# EAGLE schematic Column_PCB_Schematic (EAGLE 7.5.0), part 3 of 3
## Notes on the sheet
- I/O Ribbon Cables

## Power pins joined to a net without a drawn wire
GND: IC1.4(GND)
VCC: IC1.12(VCC)

## Library data of the parts
C1-C13 = adafruit:C-US: CAPACITOR, American symbol
IC1 = 74ac-logic:74AC11238: 3 to 8 line DECODER/DEMULTIPLEXER
MUX_SEL = con-rib:SH5-4: RIBBON CABLE CONNECTOR Flachstecker / Faston; OC_FARNELL: unknown; OC_NEWARK: unknown
PIN1-PIN7 = con-samtec:SSW-101-02-S-S: THROUGH-HOLE .025" SQ POST SOCKET Source: Samtec SSW.pdf; MPN: SSW-101-02-S-S; OC_FARNELL: unknown; OC_NEWARK: 11P9336
PWRSEL = con-rib:SH5-3: RIBBON CABLE CONNECTOR Flachstecker / Faston; OC_FARNELL: unknown; OC_NEWARK: unknown
RN1 = resistor-sil:G08R: SIL RESISTOR; OC_FARNELL: unknown; OC_NEWARK: unknown
U$1-U$12 = SparkFun-AnalogIC:MUX-74HC4067: 16-channel analog MUX; PROD_ID: IC-08252
X4-X7 X10-X13 X16-X19 X22-X25 X28-X31 X34-X37 X40-X43 = con-samtec:SSW-140-02-S-S: THROUGH-HOLE .025" SQ POST SOCKET Source: Samtec SSW.pdf; MPN: SSW-140-02-S-S; OC_FARNELL: unknown; OC_NEWARK: 11P9957
X8 X14 X20 X26 X32 X38 X44 = con-samtec:SSW-105-02-S-S: THROUGH-HOLE .025" SQ POST SOCKET Source: Samtec SSW.pdf; MPN: SSW-105-02-S-S; OC_FARNELL: unknown; OC_NEWARK: 11P9399
X9 X15 X21 X27 X33 X39 X45 = con-samtec:SSW-104-02-S-S: THROUGH-HOLE .025" SQ POST SOCKET Source: Samtec SSW.pdf; MPN: SSW-104-02-S-S; OC_FARNELL: unknown; OC_NEWARK: 11P9384

## Module MUX_PULLDOWN-NETWORK
Ports: 

### Library data of the parts

## Module MUX_PULLDOWN_16_TO_BUS
Ports: BUS0(io) BUS1(io) BUS2(io) BUS3(io) BUS4(io) BUS5(io) BUS6(io) BUS7(io) BUS8(io) BUS9(io) BUS10(io) BUS11(io) BUS12(io) BUS13(io) BUS14(io) BUS15(io) GND(io) BUS[0..15](io)
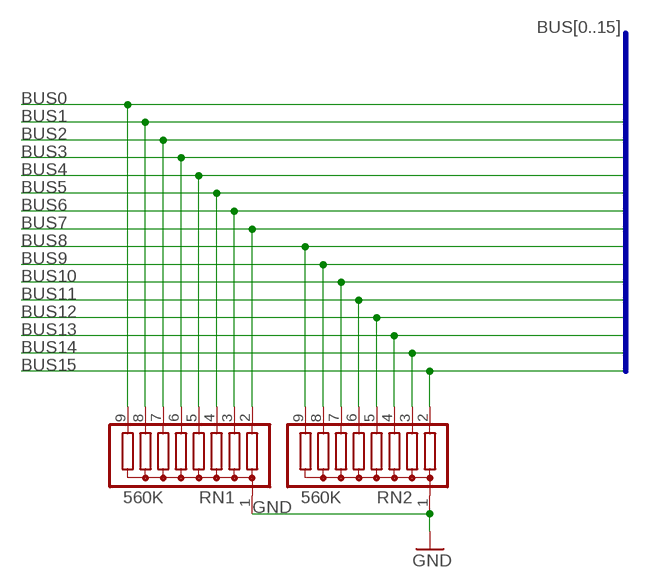
[diagram p8: schematic, module MUX_PULLDOWN_16_TO_BUS, sheet 1]

### Parts
RN1  560K  G08R  [SIL9]
RN2  560K  G08R  [SIL9]

### Nets
BUS0: RN1.9
BUS1: RN1.8
BUS2: RN1.7
BUS3: RN1.6
BUS4: RN1.5
BUS5: RN1.4
BUS6: RN1.3
BUS7: RN1.2
BUS8: RN2.9
BUS9: RN2.8
BUS10: RN2.7
BUS11: RN2.6
BUS12: RN2.5
BUS13: RN2.4
BUS14: RN2.3
BUS15: RN2.2
GND: RN1.1 RN2.1

### Buses
BUS[0..15]

### Library data of the parts
RN1 RN2 = resistor-sil:G08R: SIL RESISTOR; OC_FARNELL: unknown; OC_NEWARK: unknown

## Module 16_TO_BUS
Ports: BUS15(io) BUS14(io) BUS13(io) BUS12(io) BUS11(io) BUS10(io) BUS9(io) BUS8(io) BUS7(io) BUS6(io) BUS5(io) BUS4(io) BUS3(io) BUS2(io) BUS1(io) BUS0(io) BUS[0..15](io)
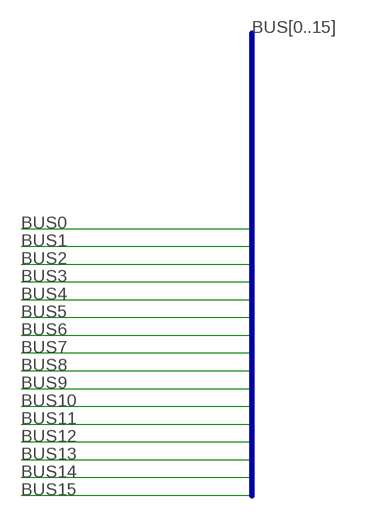
[diagram p9: schematic, module 16_TO_BUS, sheet 1]

### Buses
BUS[0..15]

### Library data of the parts